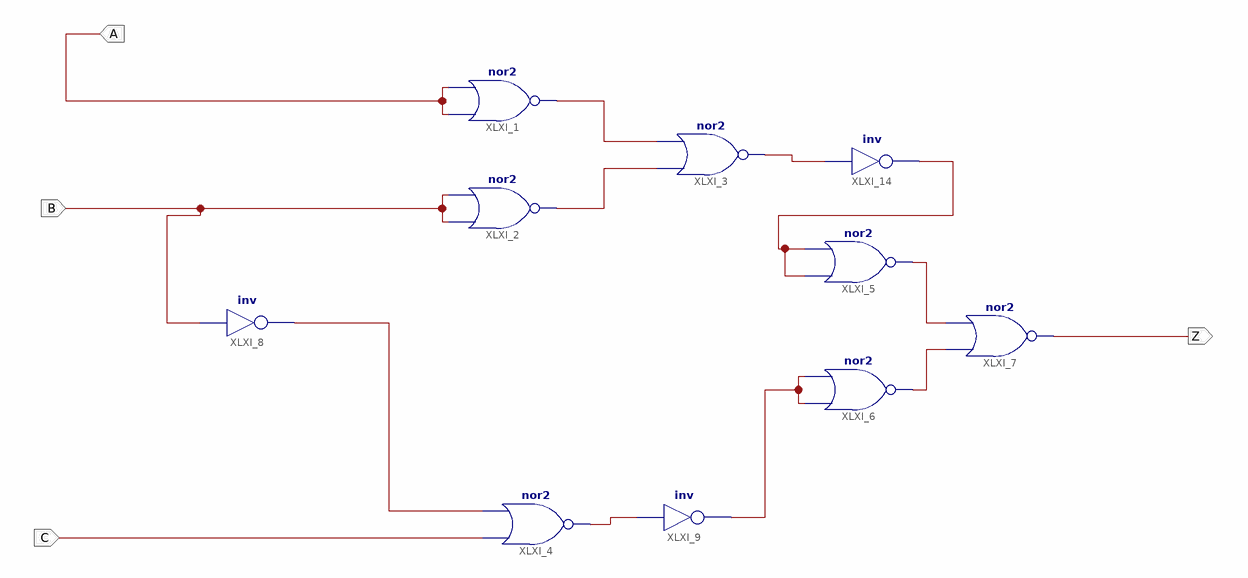
[diagram p0: schematic sheet 1]
// Xilinx ISE schematic p1ej3b.sch (spartan3) as structural Verilog: 10 symbols, 4 ports
module p1ej3b (
  input  B,
  input  C,
  input  A,
  output Z
);

  wire XLXN_2, XLXN_3, XLXN_6, XLXN_7, XLXN_9, XLXN_10, XLXN_11, XLXN_18, XLXN_19;

  nor XLXI_1 (XLXN_9, A, A);
  nor XLXI_2 (XLXN_10, B, B);
  nor XLXI_3 (XLXN_18, XLXN_10, XLXN_9);
  nor XLXI_4 (XLXN_7, C, XLXN_11);
  not XLXI_8 (XLXN_11, B);
  not XLXI_9 (XLXN_6, XLXN_7);
  nor XLXI_5 (XLXN_3, XLXN_19, XLXN_19);
  nor XLXI_6 (XLXN_2, XLXN_6, XLXN_6);
  nor XLXI_7 (Z, XLXN_2, XLXN_3);
  not XLXI_14 (XLXN_19, XLXN_18);
endmodule
